# EasyEDA schematic R4_Odzyskowa.json
TITLE: Sheet_1; REV: 1.0; Date: 2021-06-28; Sheet: 1/1; Drawn By: KowalDrzo; Company: Your Company
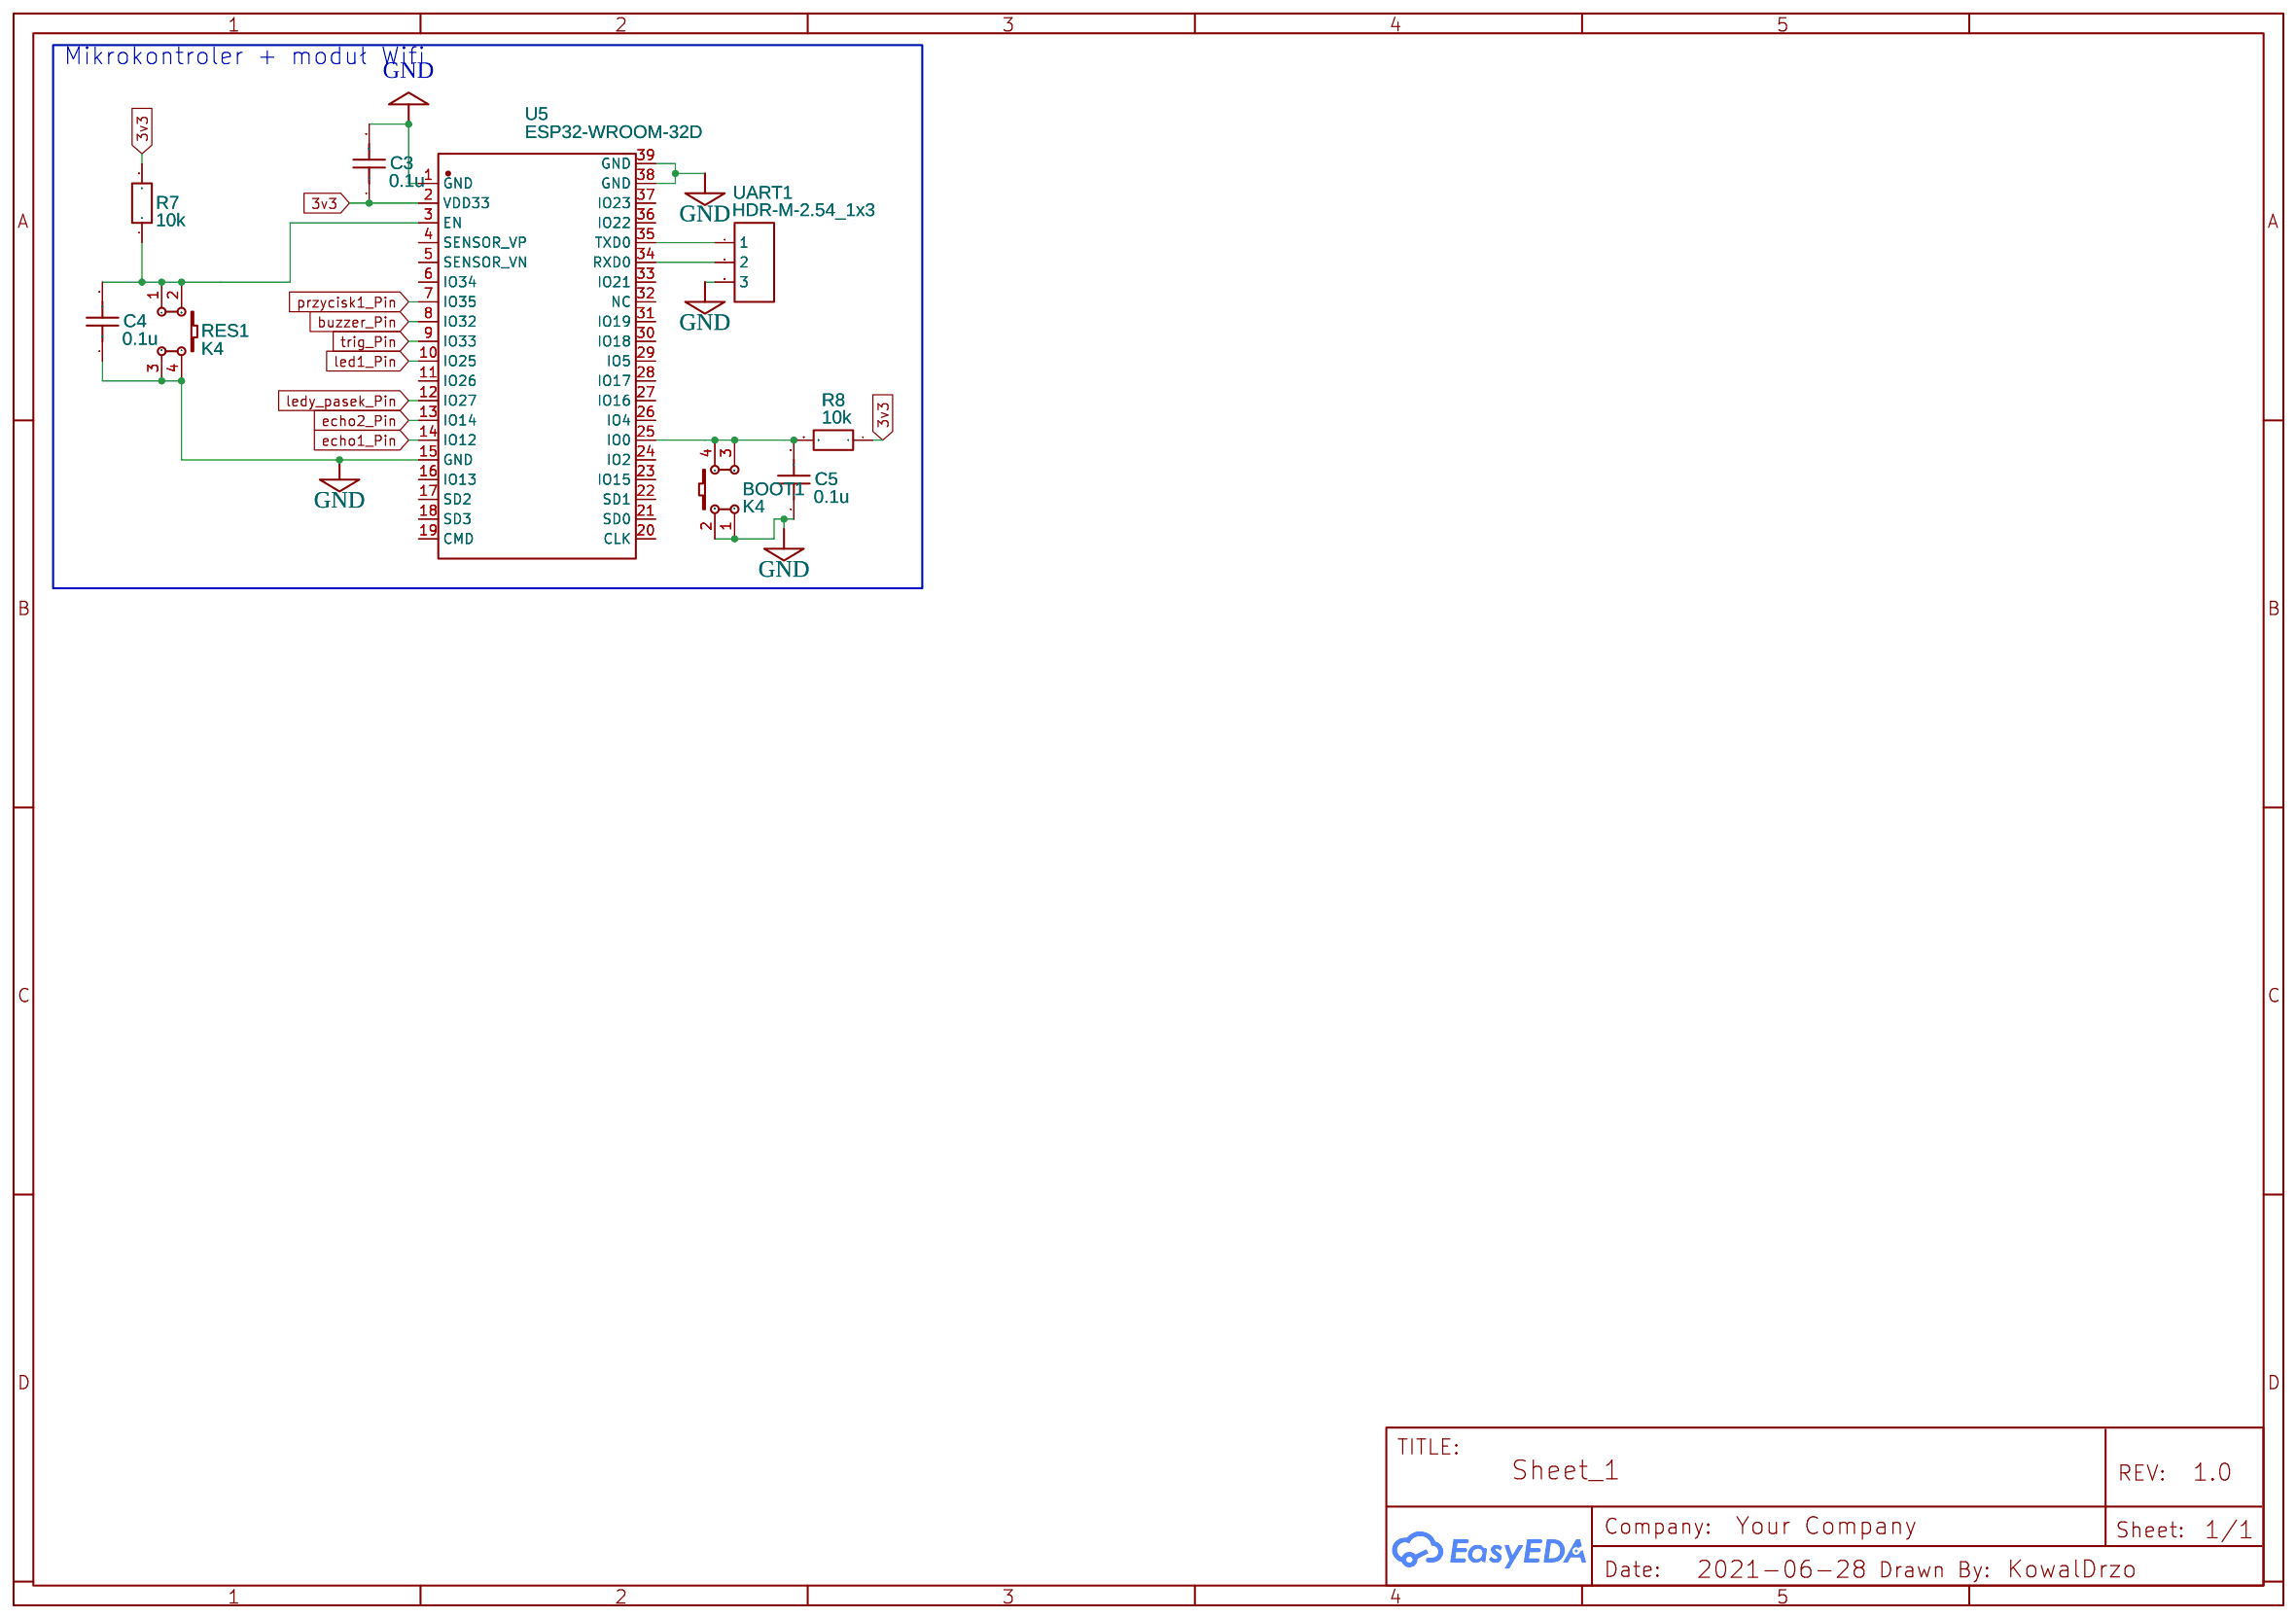
[diagram p0: schematic sheet]

## Parts
BOOT1  K4  [KEY-TH_4P-L6.0-W6.0-P4.50-LS6.5]
C3  0.1u  [C0805]
C4  0.1u  [C0805]
C5  0.1u  [C0805]
R7  10k  [R0805]
R8  10k  [R0805]
RES1  K4  [KEY-TH_4P-L6.0-W6.0-P4.50-LS6.5]
U5  ESP32-WROOM-32D  [WIFIM-SMD_39P-L25.5-W18.0-P1.27-BL]
UART1  HDR-M-2.54_1x3  [HDR-M-2.54_1X3]

## Library data of the parts
BOOT1 RES1 = K4-6×6_TH: Supplier: LCSC; Supplier Part: C136684; Manufacturer: 韩国韩荣; Manufacturer Part: K2-1102DP-E4SW-04; Contributor: LCEDA_Lib
C3-C5 = C_0805_US: Contributor: LCEDA_Lib
R7 R8 = R_0805_EU: Contributor: LCEDA_Lib
U5 = ESP32-WROOM-32D: Supplier: LCSC; Supplier Part: C473012; Manufacturer: ESPRESSIF 乐鑫; Contributor: LCSC; Paste Type: expand
UART1 = HDR-M-2.54_1x3: Supplier Part: C180248; Supplier: LCSC; Contributor: LCEDA_Lib

## Nets
3v3: C3.1 R7.2 R8.1 U5.2(VDD33)
GND: BOOT1.1 BOOT1.2 C3.2 C4.1 C5.1 RES1.3 RES1.4 U5.1(GND) U5.15(GND) U5.38(GND) U5.39(GND) UART1.3
buzzer_Pin: U5.8(IO32)
echo1_Pin: U5.14(IO12)
echo2_Pin: U5.13(IO14)
led1_Pin: U5.10(IO25)
ledy_pasek_Pin: U5.12(IO27)
przycisk1_Pin: U5.7(IO35)
trig_Pin: U5.9(IO33)
Net-(BOOT1-3): BOOT1.3 BOOT1.4 C5.2 R8.2 U5.25(IO0)
Net-(C4-2): C4.2 R7.1 RES1.1 RES1.2 U5.3(EN)
Net-(U5-34): U5.34(RXD0) UART1.2
Net-(U5-35): U5.35(TXD0) UART1.1

Not connected (* = marked no-connect by the designer): U5 4(SENSOR_VP) 5(SENSOR_VN) 6(IO34) 11(IO26) 16(IO13) 17(SD2) 18(SD3) 19(CMD) 20(CLK) 21(SD0) 22(SD1) 23(IO15) 24(IO2) 26(IO4) 27(IO16) 28(IO17) 29(IO5) 30(IO18) 31(IO19) 32(NC) 33(IO21) 36(IO22) 37(IO23)

## Notes on the sheet
- Mikrokontroler + moduł Wifi
